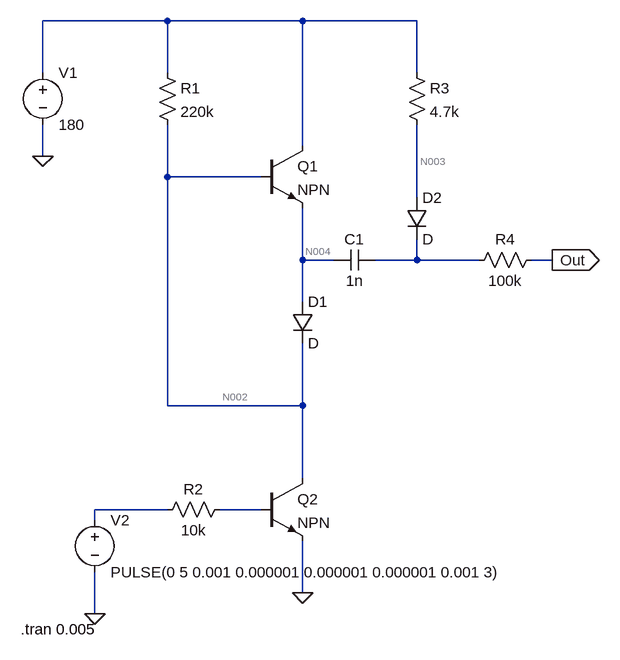
[diagram p0: schematic 64nixie.asc]
64nixie.asc, the LTspice schematic file:
Version 4
SHEET 1 932 920
WIRE 240 -32 48 -32
WIRE 448 -32 240 -32
WIRE 624 -32 448 -32
WIRE 48 48 48 -32
WIRE 240 48 240 -32
WIRE 624 48 624 -32
WIRE 448 160 448 -32
WIRE 48 176 48 128
WIRE 240 208 240 128
WIRE 384 208 240 208
WIRE 624 240 624 128
WIRE 448 336 448 256
WIRE 496 336 448 336
WIRE 624 336 624 304
WIRE 624 336 560 336
WIRE 720 336 624 336
WIRE 832 336 800 336
WIRE 448 400 448 336
WIRE 240 560 240 208
WIRE 448 560 448 464
WIRE 448 560 240 560
WIRE 448 672 448 560
WIRE 240 720 128 720
WIRE 384 720 320 720
WIRE 128 736 128 720
WIRE 448 848 448 768
WIRE 128 880 128 816
FLAG 448 848 0
FLAG 128 880 0
FLAG 48 176 0
FLAG 832 336 Out
IOPIN 832 336 Out
SYMBOL voltage 128 720 R0
WINDOW 123 0 0 Left 2
WINDOW 39 0 0 Left 2
SYMATTR InstName V2
SYMATTR Value PULSE(0 5 0.001 0.000001 0.000001 0.000001 0.001 3)
SYMBOL npn 384 160 R0
SYMATTR InstName Q1
SYMBOL npn 384 672 R0
SYMATTR InstName Q2
SYMBOL diode 432 400 R0
SYMATTR InstName D1
SYMBOL res 336 704 R90
WINDOW 0 0 56 VBottom 2
WINDOW 3 32 56 VTop 2
SYMATTR InstName R2
SYMATTR Value 10k
SYMBOL res 224 32 R0
SYMATTR InstName R1
SYMATTR Value 220k
SYMBOL res 608 32 R0
SYMATTR InstName R3
SYMATTR Value 4.7k
SYMBOL diode 608 240 R0
SYMATTR InstName D2
SYMBOL cap 560 320 R90
WINDOW 0 0 32 VBottom 2
WINDOW 3 32 32 VTop 2
SYMATTR InstName C1
SYMATTR Value 1n
SYMBOL res 816 320 R90
WINDOW 0 0 56 VBottom 2
WINDOW 3 32 56 VTop 2
SYMATTR InstName R4
SYMATTR Value 100k
SYMBOL voltage 48 32 R0
SYMATTR InstName V1
SYMATTR Value 180
TEXT 14 904 Left 2 !.tran 0.005

The netlist it stands for:
* 64nixie.asc
V2 N006 0 PULSE(0 5 0.001 0.000001 0.000001 0.000001 0.001 3)
Q1 N001 N002 N004 0 NPN
Q2 N002 N007 0 0 NPN
D1 N004 N002 D
R2 N007 N006 10k
R1 N001 N002 220k
R3 N001 N003 4.7k
D2 N003 N005 D
C1 N005 N004 1n
R4 Out N005 100k
V1 N001 0 180
.model D D
.lib standard.dio
.model NPN NPN
.model PNP PNP
.lib standard.bjt
.tran 0.005
.backanno
.end

* Results of the author's LTspice run, read from the files saved beside the schematic
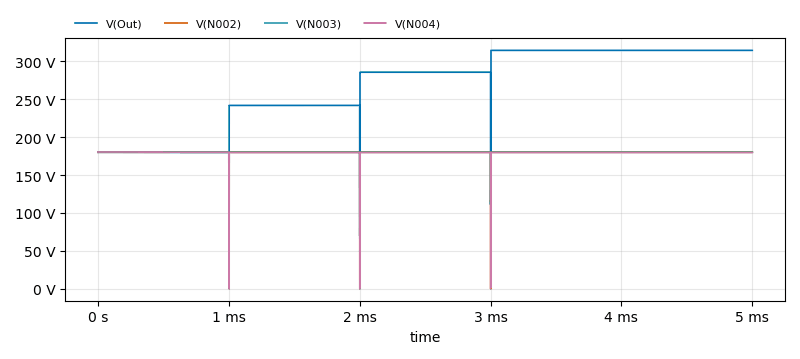
[diagram p1: Transient Analysis of 64nixie.asc, plotted from the saved traces]
* Transient Analysis, 1 run:
*   V(Out): min 17.08 V, max 314.2 V, average 266.8 V, rms 271.7 V, last 314.2 V
*   V(N002): min 96.63 mV, max 180 V, average 179.7 V, rms 179.9 V, last 180 V
*   V(N003): min 17.83 V, max 180 V, average 179.9 V, rms 179.9 V, last 180 V
*   V(N004): min 813.5 mV, max 180.3 V, average 179.5 V, rms 179.6 V, last 179.6 V